# Altium schematic sheet PT-MIS-PCB-008_v1 Project.SchDoc
size A4
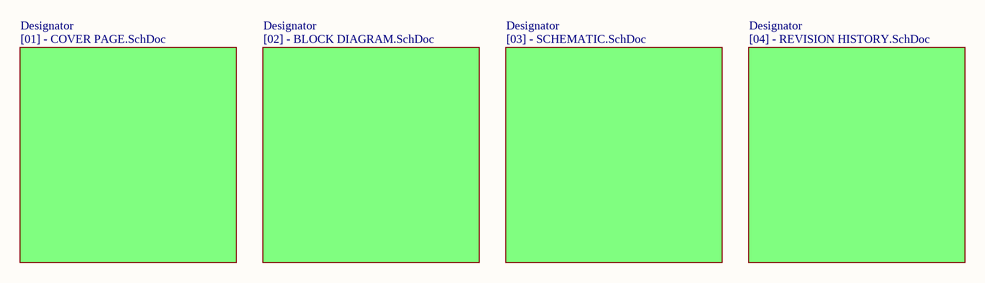
[diagram p0: PT-MIS-PCB-008_v1 Project.SchDoc]

## Sub-sheets
Designator = [01] - COVER PAGE.SchDoc: no entries
Designator = [02] - BLOCK DIAGRAM.SchDoc: no entries
Designator = [04] - REVISION HISTORY.SchDoc: no entries
Designator = [03] - SCHEMATIC.SchDoc: no entries